# Altium schematic sheet HV_boost.SchDoc
size A4; DocumentNumber: 4; SheetNumber: 4; SheetTotal: 10
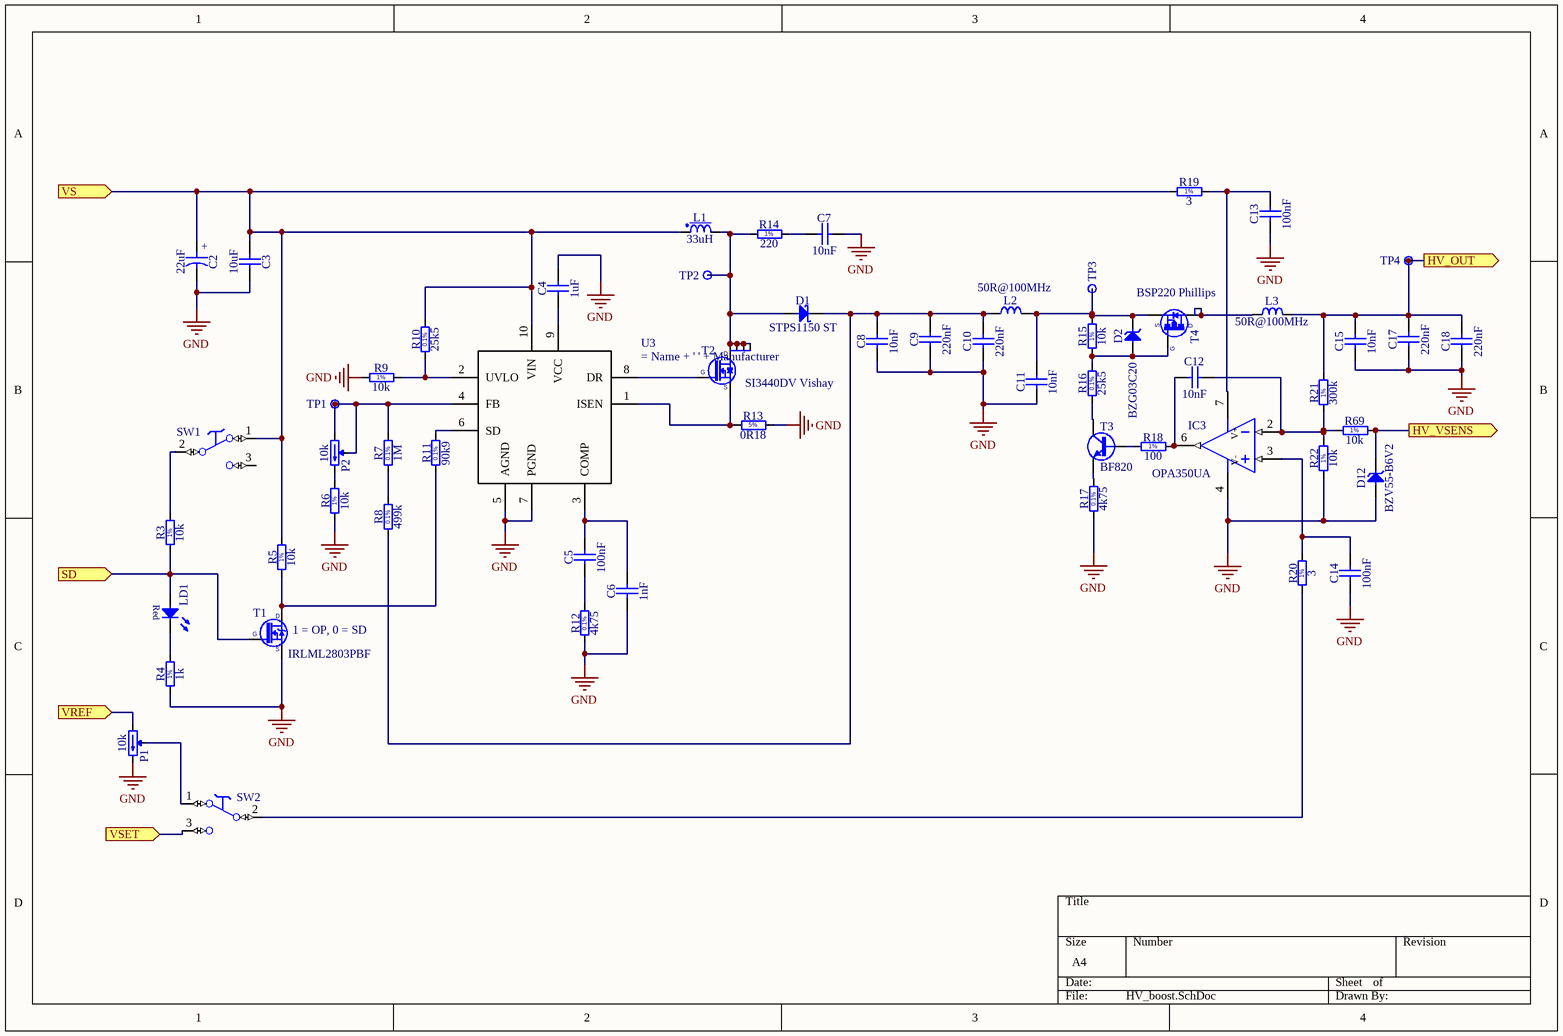
[diagram p0: HV_boost.SchDoc]

## Parts
C2  22uF  [CAPAE530X540N]
C3  10uF  [CAPC3216X180N]
C4  1uF  [CAPC2012X135N]
C5  100nF  [CAPC2012X135N]
C6  1nF  [CAPC2012X135N]
C7  10nF  [CAPC3216X100N]
C8  10nF  [CAPC3216X100N]
C9  220nF  [CAPR500-350X720X850]
C10  220nF  [CAPR500-350X720X850]
C11  10nF  [CAPC3216X100N]
C12  10nF  [CAPC2012X135N]
C13  100nF  [CAPC2012X135N]
C14  100nF  [CAPC2012X135N]
C15  10nF  [CAPC3216X100N]
C17  220nF  [CAPR500-350X720X850]
C18  220nF  [CAPR500-350X720X850]
D1  STPS1150 ST  [DIOM5027X244N]
D2  BZG03C20  [DIOM5326X230N]
D12  BZV55-B6V2  [DIOMELF3515N]
IC3  OPA350UA  [SOIC127P600X175-8N]
L1  33uH  [IND_PANASONIC_ELL6RH]
L2  50R@100MHz  [IND_MURATA_BLM31PG]
L3  50R@100MHz  [IND_MURATA_BLM31PG]
LD1  Super Red  [LED_OSRAM_LSR976]  (value not drawn)
P1  10k  [TRIM_BOURNS_3266W]
P2  10k  [TRIM_BOURNS_3266W]
R3  10k  [RESC2012X60N]
R4  1k  [RESC2012X60N]
R5  10k  [RESC2012X60N]
R6  10k  [RESC2012X60N]
R7  1M  [RESC2012X60N]
R8  499k  [RESC2012X60N]
R9  10k  [RESC2012X60N]
R10  25k5  [RESC2012X60N]
R11  90k9  [RESC2012X60N]
R12  4k75  [RESC2012X60N]
R13  0R18  [RESC2012X70N]
R14  220  [RESC3216X65N]
R15  10k  [RESC2012X60N]
R16  25k5  [RESC2012X60N]
R17  4k75  [RESC2012X60N]
R18  100  [RESC2012X60N]
R19  3  [RESC2012X60N]
R20  3  [RESC2012X60N]
R21  300k  [RESC2012X60N]
R22  10k  [RESC2012X60N]
R69  10k  [RESC2012X60N]
SW1  Switch  [SW_TYCO_1-1437575-4]  (value not drawn)
SW2  Switch  [SW_TYCO_1-1437575-4]  (value not drawn)
T1  IRLML2803PBF  [SOT95P237X112-3N]
T2  SI3440DV Vishay  [SOT95P280X110-6N]
T3  BF820  [SOT95P230X110-3N]
T4  BSP220 Phillips  [SOT230P700X175-4N]
TP1  Test Point  [VERO_20-2136]  (value not drawn)
TP2  Test Point  [VERO_20-2136]  (value not drawn)
TP3  Test Point  [VERO_20-2136]  (value not drawn)
TP4  Test Point  [VERO_20-2136]  (value not drawn)
U3  (no value)  [SOP50P490X110-10N]

## Ports
HV_OUT (out), HV_VSENS (out), SD (in), VREF (in), VS (in), VSET (in)

## Nets
GND: C2.2 C3.2 C4.2 C6.1 C7.2 C8.1 C9.1 C10.1 C11.1 C13.1 C14.1 C15.1 C17.1 C18.1 D12.2(A) IC3.4(V-) P1.3(CW) R4.1 R6.1 R9.1 R12.1 R13.2 R17.1 R22.1 T1.2(S) U3.5(AGND) U3.7(PGND)
HV_OUT: C15.2 C17.2 C18.2 L3.2 R21.2 TP4.1 ; port HV_OUT
HV_VSENS: D12.1(C) R69.2 ; port HV_VSENS
SD: LD1.2(A) R3.1 T1.1(G) ; port SD
VREF: P1.1(CCW) ; port VREF
VS: C2.1 C3.1 L1.1 R5.2 R10.2 R19.1 SW1.1(NC) U3.10(VIN) ; port VS
VSET: SW2.3(NO) ; port VSET
NetC4_1: C4.1 U3.9(VCC)
NetC5_1: C5.1 R12.2
NetC5_2: C5.2 C6.2 U3.3(COMP)
NetC7_1: C7.1 R14.2
NetC8_2: C8.2 C9.2 C10.2 D1.1(C) L2.1 R8.1
NetC11_2: C11.2 D2.1(C) L2.2 R15.2 T4.3(S) TP3.1
NetC12_1: C12.1 IC3.6(OUT) R18.2
NetC12_2: C12.2 IC3.2(IN-) R21.1 R22.2 R69.1
NetC13_2: C13.2 IC3.7(V+) R19.2
NetC14_2: C14.2 IC3.3(IN+) R20.2
NetD1_2: D1.2(A) L1.2 R14.1 T2.1(D) T2.2(D) T2.5(D) T2.6(D) TP2.1
NetD2_2: D2.2(A) R15.1 R16.2 T4.1(G)
NetL3_1: L3.1 T4.2(D) T4.4(D)
NetLD1_1: LD1.1(C) R4.2
NetP1_2: P1.2(W) SW2.1(NC)
NetP2_1: P2.1(CCW) P2.2(W) R7.2 TP1.1 U3.4(FB)
NetP2_3: P2.3(CW) R6.2
NetR3_2: R3.2 SW1.2(C)
NetR5_1: R5.1 R11.1 T1.3(D)
NetR7_1: R7.1 R8.2
NetR9_2: R9.2 R10.1 U3.2(UVLO)
NetR11_2: R11.2 U3.6(SD)
NetR13_1: R13.1 T2.4(S) U3.1(ISEN)
NetR16_1: R16.1 T3.3(C)
NetR17_2: R17.2 T3.2(E)
NetR18_1: R18.1 T3.1(B)
NetR20_1: R20.1 SW2.2(C)
NetT2_3: T2.3(G) U3.8(DR)

Not connected (* = marked no-connect by the designer): SW1 3(NO)

## Notes on the sheet
- (near T1) 1 = OP, 0 = SD
- (in symbol CAE530-540_22UF_16V_20%) +
- (in symbol LED_OSRAM_LSR976) Red
- (in symbol R0805_0R18_5%_0.25W_250PPM_PANASONIC_ERJ) 5%
- (in symbol R0805_1K_1%_0.33W_100PPM_VISHAY_CRCW-HP) 1%
- (in symbol R0805_1M_0.1%_0.1W_25PPM) 0.1%
- (in symbol R0805_3R_1%_0.125W_200PPM) 1%
- (in symbol R0805_4K75_0.1%_0.1W_10PPM) 0.1%
- (in symbol R0805_10K_1%_0.125W_100PPM) 1%
- (in symbol R0805_25K5_0.1%_0.1W_10PPM) 0.1%
- (in symbol R0805_90K9_0.1%_0.1W_10PPM) 0.1%
- (in symbol R0805_100R_1%_0.125W_100PPM) 1%
- (in symbol R0805_300K_1%_0.125W_100PPM) 1%
- (in symbol R0805_499K_0.1%_0.25W_25PPM_150V) 0.1%
- (in symbol R1206_220R_1%_0.25W_100PPM) 1%

## Library data of the parts
C2 = CAE530-540_22UF_16V_20%: Polarised capacitor; Part Description: Aluminum Electrolytic SMT Capacitor; Manufacturer: PANASONIC; Manufacturer Part Number: EEEFK1C220AR; Voltage: 16V; Tolerance: ±20%; Part Number: CAE530-540_22UF_16V_20%; Component Kind: Standard; Component Type: Standard; Pin Count: 2; Value: 22uF; Status: Not Recommended; Case: B; Mounted: Yes; Socket: No; SMD: Yes; Sense: No; ComponentHeight: 5.8mm; HelpURL: \\cern.ch\dfs\Applications\Altium\Datasheets\CAE_PANASONIC_FK.pdf; Author: CERN DEM JLC; CreateDate: 03.12.2007; LatestRevisionDate: 05.11.2014
C3 = CC1206_10UF_25V_10%_X7R: Non-polarised capacitor; Part Description: SMD Multilayer Chip Ceramic Capacitor; Manufacturer: GENERIC; Manufacturer1 Part Number: C1206C106K4RACTU; Voltage: 25V; TC: X7R; Tolerance: ±10%; Part Number: CC1206_10UF_25V_10%_X7R; Component Kind: Standard; Component Type: Standard; Pin Count: 2; Value: 10uF; Status: Preferred; Manufacturer Part Number: CC1206_10uF_25V_10%_X7R; Case: 1206; Mounted: Yes; Socket: No; SMD: Yes; Sense: No; Manufacturer1 Example: KEMET; Manufacturer1 ComponentHeight: 1.8mm; HelpURL: \\cern.ch\dfs\Applications\Altium\Datasheets\CC1206_X7R_KEMET.pdf; Author: CERN DEM JLC; CreateDate: 12.09.2012; LatestRevisionDate: 12.09.2012
C4 = CC0805_1UF_16V_10%_X7R: Non-polarised capacitor; Part Description: SMD Multilayer Chip Ceramic Capacitor; Manufacturer: GENERIC; Manufacturer1 Part Number: C2012X7R1C105K125AA; Voltage: 16V; TC: X7R; Tolerance: ±10%; Part Number: CC0805_1UF_16V_10%_X7R; Component Kind: Standard; Component Type: Standard; Pin Count: 2; Value: 1uF; Status: Preferred; Manufacturer Part Number: CC0805_1UF_16V_10%_X7R; Case: 0805; Mounted: Yes; Socket: No; SMD: Yes; Sense: No; Manufacturer1 Example: TDK; Manufacturer1 ComponentHeight: 1.45mm; HelpURL: \\cern.ch\dfs\Applications\Altium\Datasheets\CC0805_X7R_TDK_C.pdf; Author: CERN DEM JLC; CreateDate: 03.12.2007; LatestRevisionDate: 22.04.2015
C5 C13 C14 = CC0805_100NF_50V_10%_X7R: Non-polarised capacitor; Part Description: SMD Multilayer Chip Ceramic Capacitor; Manufacturer: GENERIC; Manufacturer1 Part Number: C2012X7R1H104K085AA; Voltage: 50V; TC: X7R; Tolerance: ±10%; Part Number: CC0805_100NF_50V_10%_X7R; Component Kind: Standard; Component Type: Standard; Pin Count: 2; Value: 100nF; Status: Preferred; Manufacturer Part Number: CC0805_100NF_50V_10%_X7R; Case: 0805; Mounted: Yes; Socket: No; SMD: Yes; Sense: No; Manufacturer1 Example: TDK; Manufacturer1 ComponentHeight: 1mm; HelpURL: \\cern.ch\dfs\Applications\Altium\Datasheets\CC0805_X7R_TDK_C.pdf; Author: CERN DEM JLC; CreateDate: 03.12.2007; LatestRevisionDate: 22.04.2015
C6 = CC0805_1NF_50V_10%_X7R: Non-polarised capacitor; Part Description: SMD Multilayer Chip Ceramic Capacitor; Manufacturer: GENERIC; Manufacturer1 Part Number: 223858015623; Voltage: 50V; TC: X7R; Tolerance: ±10%; Part Number: CC0805_1NF_50V_10%_X7R; Component Kind: Standard; Component Type: Standard; Pin Count: 2; Value: 1nF; Status: Preferred; Manufacturer Part Number: CC0805_1NF_50V_10%_X7R; Case: 0805; Mounted: Yes; Socket: No; SMD: Yes; Sense: No; Manufacturer1 Example: PHYCOMP; Manufacturer1 ComponentHeight: 1.35mm; HelpURL: \\cern.ch\dfs\Applications\Altium\Datasheets\CC0805_X7R_PHYCOMP.pdf; Author: CERN DEM JLC; CreateDate: 03.12.2007; LatestRevisionDate: 22.04.2015
C7 C8 C11 C15 = CC1206_10NF_200V_5%_C0G: Non-polarised capacitor; Part Description: SMD Multilayer Chip Ceramic Capacitor; Manufacturer: GENERIC; Manufacturer1 Part Number: C1206C103J2GACAUTO; Voltage: 200V; TC: C0G/NP0; Tolerance: ±5%; Part Number: CC1206_10NF_200V_5%_C0G; Component Kind: Standard; Component Type: Standard; Pin Count: 2; Value: 10nF; Status: Preferred; Manufacturer Part Number: CC1206_10NF_200V_5%_C0G; Case: 1206; Mounted: Yes; Socket: No; SMD: Yes; Sense: No; Manufacturer1 Example: KEMET; Manufacturer1 ComponentHeight: 1.0mm; HelpURL: \\cern.ch\dfs\Applications\Altium\Datasheets\CC1206_C0G_KEMET.pdf; Author: CERN DEM JLC; CreateDate: 25.11.2014; LatestRevisionDate: 25.11.2014
C9 C10 C17 C18 = CPER_220NF_100V_10%_500-350X720X850: Non-polarised capacitor; Part Description: Metallized Polyester Film Capacitor (MKS2); Manufacturer: WIMA; Manufacturer Part Number: MKS2D032201C00KSSD; Voltage: 100VDC/63VAC; Tolerance: ±10%; Part Number: CPER_220NF_100V_10%_500-350X720X850; Component Kind: Standard; Component Type: Standard; Pin Count: 2; Value: 220nF; Status: None; Case: LS5 W3.5 x L7.2 x H8.5; Mounted: Yes; Socket: No; SMD: No; Sense: No; ComponentHeight: 8.5mm; HelpURL: \\cern.ch\dfs\Applications\Altium\Datasheets\CPER_WIMA_MKS2.pdf; Author: CERN DEM JLC; CreateDate: 22.03.2010; LatestRevisionDate: 30.01.2012
C12 = CC0805_10NF_50V_5%_X7R: Non-polarised capacitor; Part Description: SMD Multilayer Chip Ceramic Capacitor; Manufacturer: GENERIC; Manufacturer1 Part Number: 08055C103JAT2A; Voltage: 50V; TC: X7R; Tolerance: ±5%; Part Number: CC0805_10NF_50V_5%_X7R; Component Kind: Standard; Component Type: Standard; Pin Count: 2; Value: 10nF; Status: None; Manufacturer Part Number: CC0805_10NF_50V_5%_X7R; Case: 0805; Mounted: Yes; Socket: No; SMD: Yes; Sense: No; Manufacturer1 Example: AVX; Manufacturer1 ComponentHeight: 0.94mm; HelpURL: \\cern.ch\dfs\Applications\Altium\Datasheets\CC0805_X7R_AVX.pdf; Author: CERN DEM JLC; CreateDate: 18.01.2011; LatestRevisionDate: 18.01.2011
D1 = STPS1150: Diode Schottky  Anode Pin 1 Cathode Pin 3 (Pas de pin 2); Name: STPS1150; Manufacturer: ST
D2 = BZG03C20: Zener Diode; Part Description: Voltage Regulator Diode; Manufacturer: VISHAY SEMICONDUCTOR; Voltage: 20V; Power: 1.25W; PressFit: No; Bonding: No; Part Number: BZG03C20; Component Kind: Standard; Component Type: Standard; Device: BZG03C20; PackageDescription: DO-214-AC/SMA Molded Diode, Body 5.3x2.6mm, IPC Medium Density; Manufacturer Part Number: BZG03C20; Pin Count: 2; Case: DO-214AC; Mounted: Yes; Socket: No; SMD: Yes; Sense: No; ComponentHeight: 2.3mm; HelpURL: \\cern.ch\dfs\Applications\Altium\Datasheets\BZG03C.pdf; Author: CERN DEM JLC; CreateDate: 02.06.2008; LatestRevisionDate: 02.06.2008
D12 = BZV55-B6V2: Zener Diode; Part Description: Voltage Regulator Diode; Manufacturer: NXP SEMICONDUCTORS; Voltage: 6V2; Power: 500mW; PressFit: No; Bonding: No; Part Number: BZV55-B6V2; Component Kind: Standard; Component Type: Standard; Device: BZV55-B6V2; PackageDescription: SOD80C, MELF Diode, 2-Leads, Body 3.5x1.5mm, IPC Medium Density; Manufacturer Part Number: BZV55-B6V2; Pin Count: 2; Case: SOD-80C; Mounted: Yes; Socket: No; SMD: Yes; Sense: No; ComponentHeight: 1.6mm; HelpURL: \\cern.ch\dfs\Applications\Altium\Datasheets\BZV55.pdf; Author: CERN DEM JLC; CreateDate: 06.05.2008; LatestRevisionDate: 06.05.2008
IC3 = OPA350UA: Operational Amplifier; Part Description: High-Speed, Single-Supply, Rail-to-Rail Operational Amplifier; Manufacturer: TEXAS INSTRUMENTS; PressFit: No; Bonding: No; Part Number: OPA350UA; Component Kind: Standard; Component Type: Standard; Device: OPA350UA; PackageDescription: SOIC 8, Pitch 1.27mm - Body 4x5mm, IPC Medium Density; Manufacturer Part Number: OPA350UA; Pin Count: 5; Case: SOIC8; Mounted: Yes; Socket: No; SMD: Yes; Sense: No; ComponentHeight: 1.75mm; Author: CERN DEM JLC; HelpURL: \\cern.ch\dfs\Applications\Altium\Datasheets\OPA350UA.pdf; CreateDate: 11.10.2012; LatestRevisionDate: 11.10.2012
L1 = IND_33UH_20%_PANASONIC_ELL6RH330M: Inductor With Magnetic core 1Dot; Part Description: SMD Choke Coil; Power: 600mA; Resistance: 0.38R; Tolerance: ±20%; Part Number: IND_33UH_20%_PANASONIC_ELL6RH330M; Component Kind: Standard; Component Type: Standard; Pin Count: 2; Value: 33uH; Status: None; Manufacturer: PANASONIC; Manufacturer Part Number: ELL6RH330M; Mounted: Yes; Socket: No; SMD: Yes; Sense: No; ComponentHeight: 2.8mm; HelpURL: \\cern.ch\dfs\Applications\Altium\Datasheets\IND_PANASONIC_ELL6RH.pdf; Author: CERN DEM JMW; CreateDate: 09.01.2009; LatestRevisionDate: 09.01.2009
L2 L3 = IND1206_MURATA_BLM31PG500SN1: Inductor; Part Description: SMD EMIFIL Chip Ferrite Bead; Manufacturer: MURATA; Power: 3.5A; Resistance: 0.015R; Part Number: IND1206_MURATA_BLM31PG500SN1; Component Kind: Standard; Component Type: Standard; Pin Count: 2; Value: 50R@100MHz; Status: None; Manufacturer Part Number: BLM31PG500SN1; Case: 1206; Mounted: Yes; Socket: No; SMD: Yes; Sense: No; ComponentHeight: 1.3mm; HelpURL: \\cern.ch\dfs\Applications\Altium\Datasheets\IND1206_MURATA_BLM31P.pdf; Author: CERN DEM JLC; CreateDate: 05.12.2013; LatestRevisionDate: 05.12.2013
LD1 = LED_OSRAM_LSR976: LED Red 1C 2A; Part Description: Surface Mount Super Red LED (0805 Case); Manufacturer: OSRAM; Manufacturer Part Number: LSR976; PressFit: No; Bonding: No; Part Number: LED_OSRAM_LSR976; Component Kind: Standard; Component Type: Standard; Color: Super Red; PackageDescription: Super Red Chip LED, 2-Leads, Body 2 x1.25mm, IPC Medium Density; Pin Count: 2; Case: 0805; Mounted: Yes; Socket: No; SMD: Yes; Sense: No; ComponentHeight: 0.9mm; HelpURL: \\cern.ch\dfs\Applications\Altium\Datasheets\LED_OSRAM_LSR976.pdf; Author: CERN DEM JLC; CreateDate: 18.05.2010; LatestRevisionDate: 18.05.2010
P1 P2 = TRIM_12T_10K_BOURNS_3266W-1-103LF: Trimming Potentiometer; Part Description: 12 Turn Trimming Potentiometer (Top Adjustement); Manufacturer: BOURNS; Power: 0.25W; TC: ±100ppm/°C; Tolerance: ±10%; PressFit: No; Part Number: TRIM_12T_10K_BOURNS_3266W-1-103LF; Component Kind: Standard; Component Type: Standard; Pin Count: 3; Value: 10k; Manufacturer Part Number: 3266W-1-103LF; Case: 3266W; Mounted: Yes; Socket: No; SMD: No; Sense: No; ComponentHeight: 7.75mm; HelpURL: \\cern.ch\dfs\Applications\Altium\Datasheets\TRIM_BOURNS_3266W.pdf; Author: CERN DEM JLC; CreateDate: 10.06.2008; LatestRevisionDate: 28.11.2012
R3 R5 R6 R9 R15 R22 R69 = R0805_10K_1%_0.125W_100PPM: Resistor - 1%; Part Description: General Purpose Thick Film Chip Resistor; Manufacturer: GENERIC; Manufacturer1 Part Number: NRC10F1002TRF; Power: 0.125W; TC: ±100ppm/°C; PressFit: No; Part Number: R0805_10K_1%_0.125W_100PPM; Component Kind: Standard; Component Type: Standard; Pin Count: 2; Value: 10k; Status: Preferred; Tolerance: ±1%; Manufacturer Part Number: R0805_10K_1%_0.125W_100PPM; Case: 0805; Mounted: Yes; Sense: No; Socket: No; SMD: Yes; Manufacturer1 Example: NIC COMPONENT; Manufacturer1 ComponentHeight: 0.6mm; HelpURL: \\cern.ch\dfs\Applications\Altium\Datasheets\R0805_NIC_NRC.pdf; Author: CERN DEM JLC; CreateDate: 03.12.2007; LatestRevisionDate: 13.03.2008
R4 = R0805_1K_1%_0.33W_100PPM_VISHAY_CRCW-HP: Resistor - 1%; Part Description: 150V, Pulse Proof, High Power Thick Film Chip Resistor; Manufacturer: VISHAY DRALORIC; Manufacturer Part Number: CRCW08051K00FKEAHP; Power: 0.33W; TC: ±100ppm/°C; PressFit: No; Part Number: R0805_1K_1%_0.33W_100PPM_VISHAY_CRCW-HP; Component Kind: Standard; Component Type: Standard; Pin Count: 2; Value: 1k; Status: None; Tolerance: ±1%; Case: 0805; Mounted: Yes; Sense: No; Socket: No; SMD: Yes; Manufacturer1 ComponentHeight: 0.6mm; HelpURL: \\cern.ch\dfs\Applications\Altium\Datasheets\R0805_VISHAY_CRCW-HP e3.pdf; Author: CERN DEM JLC; CreateDate: 16.06.2010; LatestRevisionDate: 16.06.2010
R7 = R0805_1M_0.1%_0.1W_25PPM: Resistor - 0.1%; Part Description: Precision Surface Mount Resistor; Manufacturer: GENERIC; Manufacturer1 Part Number: PCF0805R-1M0BT1; Power: 0.1W; TC: ±25ppm/°C; PressFit: No; Part Number: R0805_1M_0.1%_0.1W_25PPM; Component Kind: Standard; Component Type: Standard; Pin Count: 2; Value: 1M; Status: Not Recommended; Tolerance: ±0.1%; Manufacturer Part Number: R0805_1M_0.1%_0.1W_25PPM; Case: 0805; Mounted: Yes; Sense: No; Socket: No; SMD: Yes; Manufacturer1 Example: WELWYN COMPONENTS; HelpURL: \\cern.ch\dfs\Applications\Altium\Datasheets\R0805_WELWYN_PCF0805R.pdf; Author: CERN DEM JLC; CreateDate: 17.11.2008; LatestRevisionDate: 26.04.2010
R8 = R0805_499K_0.1%_0.25W_25PPM_150V: Resistor - 0.1%; Part Description: Thin Film Chip Resistor; Manufacturer: GENERIC; Manufacturer1 Part Number: RP73PF2A499KBTDF; Power: 0.25W; TC: ±25ppm/°C; Voltage: 150V; PressFit: No; Part Number: R0805_499K_0.1%_0.25W_25PPM_150V; Component Kind: Standard; Component Type: Standard; Pin Count: 2; Value: 499k; Status: None; Tolerance: ±0.1%; Manufacturer Part Number: R0805_499K_0.1%_0.25W_25PPM_150V; Case: 0805; Mounted: Yes; Sense: No; Socket: No; SMD: Yes; Manufacturer1 Example: TYCO ELECTRONICS; Manufacturer1 ComponentHeight: 0.65mm; HelpURL: \\cern.ch\dfs\Applications\Altium\Datasheets\R0805_TYCO_RP73.pdf; Author: CERN DEM BC; CreateDate: 04.12.2015; LatestRevisionDate: 04.12.2015
R10 R16 = R0805_25K5_0.1%_0.1W_10PPM: Resistor - 0.1%; Part Description: Thin Film Chip Resistor; Manufacturer: GENERIC; Manufacturer1 Part Number: RN73C2A25K5BTG; Power: 0.1W; TC: ±10ppm; PressFit: No; Part Number: R0805_25K5_0.1%_0.1W_10PPM; Component Kind: Standard; Component Type: Standard; Pin Count: 2; Value: 25k5; Status: Not Recommended; Tolerance: ±0.1%; Manufacturer Part Number: R0805_25K5_0.1%_0.1W_10PPM; Case: 0805; Mounted: Yes; Sense: No; Socket: No; SMD: Yes; Manufacturer1 Example: TYCO HOLSWORTHY; Manufacturer1 ComponentHeight: 0.6mm; HelpURL: \\cern.ch\dfs\Applications\Altium\Datasheets\R0805_Tyco_RN73.pdf; Author: CERN DEM JLC; CreateDate: 03.12.2007; LatestRevisionDate: 13.03.2008
R11 = R0805_90K9_0.1%_0.1W_10PPM: Resistor - 0.1%; Part Description: Thin Film Chip Resistor; Manufacturer: GENERIC; Manufacturer1 Part Number: RN73C2A90K9BTG; Power: 0.1W; TC: ±10ppm; PressFit: No; Part Number: R0805_90K9_0.1%_0.1W_10PPM; Component Kind: Standard; Component Type: Standard; Pin Count: 2; Value: 90k9; Status: Not Recommended; Tolerance: ±0.1%; Manufacturer Part Number: R0805_90K9_0.1%_0.1W_10PPM; Case: 0805; Mounted: Yes; Sense: No; Socket: No; SMD: Yes; Manufacturer1 Example: TYCO HOLSWORTHY; Manufacturer1 ComponentHeight: 0.6mm; HelpURL: \\cern.ch\dfs\Applications\Altium\Datasheets\R0805_Tyco_RN73.pdf; Author: CERN DEM JLC; CreateDate: 03.12.2007; LatestRevisionDate: 13.03.2008
R12 R17 = R0805_4K75_0.1%_0.1W_10PPM: Resistor - 0.1%; Part Description: Thin Film Chip Resistor; Manufacturer: GENERIC; Manufacturer1 Part Number: RN73C2A4K75BTG; Power: 0.1W; TC: ±10ppm; PressFit: No; Part Number: R0805_4K75_0.1%_0.1W_10PPM; Component Kind: Standard; Component Type: Standard; Pin Count: 2; Value: 4k75; Status: Not Recommended; Tolerance: ±0.1%; Manufacturer Part Number: R0805_4K75_0.1%_0.1W_10PPM; Case: 0805; Mounted: Yes; Sense: No; Socket: No; SMD: Yes; Manufacturer1 Example: TYCO HOLSWORTHY; Manufacturer1 ComponentHeight: 0.6mm; HelpURL: \\cern.ch\dfs\Applications\Altium\Datasheets\R0805_Tyco_RN73.pdf; Author: CERN DEM JLC; CreateDate: 03.12.2007; LatestRevisionDate: 13.03.2008
R13 = R0805_0R18_5%_0.25W_250PPM_PANASONIC_ERJ: Resistor - 5%; Part Description: Low Resistance Thick Film Chip Resistor; Manufacturer Part Number: ERJ6BSJR18V; Power: 0.25W; TC: ±250ppm/°C; PressFit: No; Part Number: R0805_0R18_5%_0.25W_250PPM_PANASONIC_ERJ; Component Kind: Standard; Component Type: Standard; Pin Count: 2; Value: 0R18; Status: Not Recommended; Tolerance: ±5%; Manufacturer: PANASONIC; Case: 0805; Mounted: Yes; Sense: No; Socket: No; SMD: Yes; ComponentHeight: 0.7mm; HelpURL: \\cern.ch\dfs\Applications\Altium\Datasheets\R0805_PANASONIC_ERJ.pdf; Author: CERN DEM JLC; CreateDate: 22.06.2011; LatestRevisionDate: 22.06.2011
R14 = R1206_220R_1%_0.25W_100PPM: Resistor - 1%; Part Description: General Purpose Thick Film Chip Resistor; Manufacturer: GENERIC; Manufacturer1 Part Number: NRC12F2200TRF; Power: 0.25W; TC: ±100ppm/°C; PressFit: No; Part Number: R1206_220R_1%_0.25W_100PPM; Component Kind: Standard; Component Type: Standard; Pin Count: 2; Value: 220; Status: Preferred; Tolerance: ±1%; Manufacturer Part Number: R1206_220R_1%_0.25W_100PPM; Case: 1206; Mounted: Yes; Sense: No; Socket: No; SMD: Yes; Manufacturer1 Example: NIC COMPONENT; Manufacturer1 ComponentHeight: 0.65mm; HelpURL: \\cern.ch\dfs\Applications\Altium\Datasheets\R1206_NIC_NRC.pdf; Author: CERN DEM JLC; CreateDate: 03.12.2007; LatestRevisionDate: 13.03.2008
R18 = R0805_100R_1%_0.125W_100PPM: Resistor - 1%; Part Description: General Purpose Thick Film Chip Resistor; Manufacturer: GENERIC; Manufacturer1 Part Number: NRC10F4700TRF; Power: 0.125W; TC: ±100ppm/°C; PressFit: No; Part Number: R0805_100R_1%_0.125W_100PPM; Component Kind: Standard; Component Type: Standard; Pin Count: 2; Value: 100; Status: Preferred; Tolerance: ±1%; Manufacturer Part Number: R0805_100R_1%_0.125W_100PPM; Case: 0805; Mounted: Yes; Sense: No; Socket: No; SMD: Yes; Manufacturer1 Example: NIC COMPONENT; Manufacturer1 ComponentHeight: 0.6mm; HelpURL: \\cern.ch\dfs\Applications\Altium\Datasheets\R0805_NIC_NRC.pdf; Author: CERN DEM JLC; CreateDate: 03.12.2007; LatestRevisionDate: 13.03.2008
R19 R20 = R0805_3R_1%_0.125W_200PPM: Resistor - 1%; Part Description: General Purpose Thick Film Chip Resistor; Manufacturer: GENERIC; Manufacturer1 Part Number: 232273463008L or RC0805FR-073RL; Power: 0.125W; TC: ±200ppm/°C; PressFit: No; Part Number: R0805_3R_1%_0.125W_200PPM; Component Kind: Standard; Component Type: Standard; Pin Count: 2; Value: 3; Status: Preferred; Tolerance: ±1%; Manufacturer Part Number: R0805_3R_1%_0.125W_200PPM; Case: 0805; Mounted: Yes; Sense: No; Socket: No; SMD: Yes; Manufacturer1 Example: YAGEO PHYCOMP; Manufacturer1 ComponentHeight: 0.65mm; HelpURL: \\cern.ch\dfs\Applications\Altium\Datasheets\R0805_Phycomp_RC0805.pdf; Author: CERN DEM JLC; CreateDate: 03.12.2007; LatestRevisionDate: 17.10.2012
R21 = R0805_300K_1%_0.125W_100PPM: Resistor - 1%; Part Description: General Purpose Thick Film Chip Resistor; Manufacturer: GENERIC; Manufacturer1 Part Number: NRC10F3003TRF; Power: 0.125W; TC: ±100ppm/°C; PressFit: No; Part Number: R0805_300K_1%_0.125W_100PPM; Component Kind: Standard; Component Type: Standard; Pin Count: 2; Value: 300k; Status: Preferred; Tolerance: ±1%; Manufacturer Part Number: R0805_300K_1%_0.125W_100PPM; Case: 0805; Mounted: Yes; Sense: No; Socket: No; SMD: Yes; Manufacturer1 Example: NIC COMPONENT; Manufacturer1 ComponentHeight: 0.6mm; HelpURL: \\cern.ch\dfs\Applications\Altium\Datasheets\R0805_NIC_NRC.pdf; Author: CERN DEM JLC; CreateDate: 03.12.2007; LatestRevisionDate: 13.03.2008
SW1 SW2 = SW_TYCO_1-1437575-4: SPDT Switch; Part Description: 30VDC, 100mA, Slide Low Profile SPDT Switch, SSA Series; Manufacturer: TYCO; Manufacturer Part Number: 1-1437575-4 or SSA-12; PressFit: No; Part Number: SW_TYCO_1-1437575-4; Component Kind: Standard; Component Type: Standard; Pin Count: 3; PackageDescription: Body 8.79 x 3.4mm, Slide Low Profile SPDT Switch, SSA Series; Family: Switch; Mounted: Yes; Socket: No; SMD: No; Sense: No; Status: None; ComponentHeight: 5.4mm; HelpURL: \\cern.ch\dfs\Applications\Altium\Datasheets\SW_TYCO_1-1437575-4.pdf; Author: CERN DEM JLC; CreateDate: 11.11.2013; LatestRevisionDate: 11.11.2013
T1 = IRLML2803PBF: N-CHANNEL MOSFET WITH ZENER DIODE; Part Description: 30V 1.2A  N-Channel HEXFET® Power MOSFET; Manufacturer: INTERNATIONAL RECTIFIER; PressFit: No; Bonding: No; Part Number: IRLML2803PBF; Component Kind: Standard; Component Type: Standard; Device: IRLML2803PBF; PackageDescription: SOT, 0.95mm, pitch; 3 pin,1.30mm W X 2.92mm L X 1.12mm H body, IPC Medium Density; Manufacturer Part Number: IRLML2803PBF; Pin Count: 3; Case: SOT23-3; Mounted: Yes; Socket: No; SMD: Yes; Sense: No; ComponentHeight: 1.12mm; HelpURL: \\cern.ch\dfs\Applications\Altium\Datasheets\IRLML2803PBF.pdf; Author: CERN DEM JMW; CreateDate: 08.12.2010; LatestRevisionDate: 08.12.2010
T2 = SI3440DV: N-Channel MOSFET; Name: SI3440DV; Manufacturer: Vishay
T3 = BF820: NPN Transistor; Part Description: 300V 50mA NPN High-Voltage Transistor; Manufacturer: NXP SEMICONDUCTORS; PressFit: No; Bonding: No; Part Number: BF820; Component Kind: Standard; Component Type: Standard; Device: BF820; PackageDescription: SOT23, 3 pin, Pitch 0.95mm - 1.3mm W X 2.9mm L X 1.1mm H, IPC Medium Density; Manufacturer Part Number: BF820; Pin Count: 3; Case: SOT23-3; Mounted: Yes; Socket: No; SMD: Yes; Sense: No; ComponentHeight: 1.1mm; HelpURL: \\cern.ch\dfs\Applications\Altium\Datasheets\BF820.pdf; Author: CERN DEM JLC; CreateDate: 23.09.2014; LatestRevisionDate: 23.09.2014
T4 = BSP220: P-Channel MOSFET; Name: BSP220; Manufacturer: Phillips
TP1-TP4 = VERO_20-2136: Part Description: Black Bead PCB Terminal Test Pin for 1.6mm PCB Thickness (1.32mm Hole); Manufacturer: VERO TECHNOLOGIES; PressFit: No; Part Number: VERO_20-2136; Component Kind: Standard; Component Type: Standard; Pin Count: 1; Family: Test Point; Mounted: Yes; Socket: No; SMD: No; Sense: No; Status: None; Manufacturer Part Number: 20-2136; ComponentHeight: 5.3mm; HelpURL: \\cern.ch\dfs\Applications\Altium\Datasheets\VERO_20-2136.pdf; Author: CERN DEM JLC; CreateDate: 21.07.2008; LatestRevisionDate: 15.07.2013
U3 = LM3481: Manufacutrer: TI; Name: LM3481